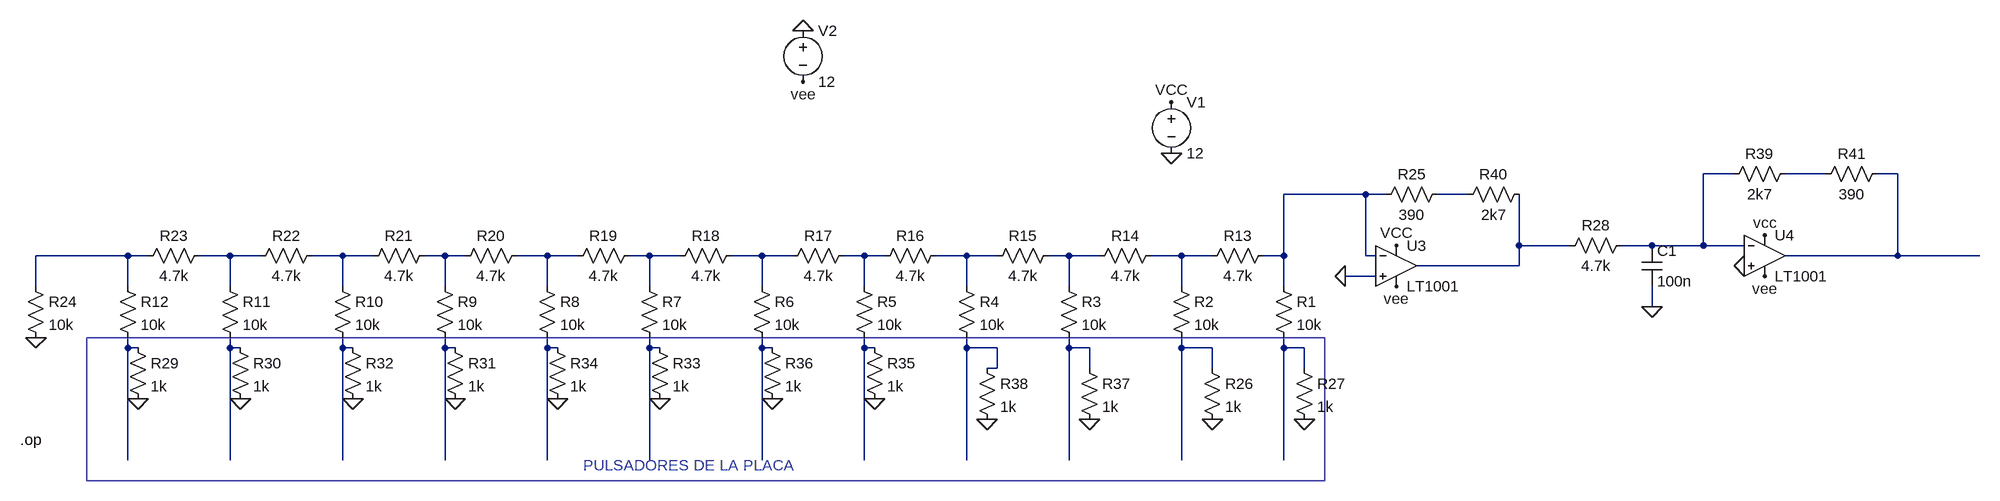
[diagram p0: schematic Teclado.asc]
Teclado.asc, the LTspice schematic file:
Version 4
SHEET 1 1376 680
WIRE 864 16 816 16
WIRE 1008 16 944 16
WIRE 1120 16 1088 16
WIRE 288 48 160 48
WIRE 320 48 288 48
WIRE 448 48 400 48
WIRE 528 128 528 48
WIRE 608 128 528 128
WIRE 736 128 688 128
WIRE 816 128 816 16
WIRE 816 128 736 128
WIRE 880 128 816 128
WIRE -1648 144 -1792 144
WIRE -1616 144 -1648 144
WIRE -1488 144 -1536 144
WIRE -1440 144 -1488 144
WIRE -1312 144 -1360 144
WIRE -1264 144 -1312 144
WIRE -1152 144 -1184 144
WIRE -1120 144 -1152 144
WIRE -992 144 -1040 144
WIRE -944 144 -992 144
WIRE -832 144 -864 144
WIRE -784 144 -832 144
WIRE -656 144 -704 144
WIRE -608 144 -656 144
WIRE -496 144 -528 144
WIRE -464 144 -496 144
WIRE -336 144 -384 144
WIRE -288 144 -336 144
WIRE -176 144 -208 144
WIRE -128 144 -176 144
WIRE 0 144 -48 144
WIRE 48 144 0 144
WIRE 160 144 160 48
WIRE 160 144 128 144
WIRE 288 144 288 48
WIRE 304 144 288 144
WIRE 1120 144 1120 16
WIRE 1120 144 944 144
WIRE 1248 144 1120 144
WIRE 528 160 528 128
WIRE 528 160 368 160
WIRE 304 176 256 176
WIRE -1792 192 -1792 144
WIRE -1648 192 -1648 144
WIRE -1488 192 -1488 144
WIRE -1312 192 -1312 144
WIRE -1152 192 -1152 144
WIRE -992 192 -992 144
WIRE -832 192 -832 144
WIRE -656 192 -656 144
WIRE -496 192 -496 144
WIRE -336 192 -336 144
WIRE -176 192 -176 144
WIRE 0 192 0 144
WIRE 160 192 160 144
WIRE 736 224 736 192
WIRE -1648 288 -1648 272
WIRE -1632 288 -1648 288
WIRE -1488 288 -1488 272
WIRE -1472 288 -1488 288
WIRE -1312 288 -1312 272
WIRE -1296 288 -1312 288
WIRE -1152 288 -1152 272
WIRE -1136 288 -1152 288
WIRE -992 288 -992 272
WIRE -976 288 -992 288
WIRE -832 288 -832 272
WIRE -816 288 -832 288
WIRE -656 288 -656 272
WIRE -640 288 -656 288
WIRE -496 288 -496 272
WIRE -480 288 -496 288
WIRE -336 288 -336 272
WIRE -288 288 -336 288
WIRE -176 288 -176 272
WIRE -144 288 -176 288
WIRE 0 288 0 272
WIRE 48 288 0 288
WIRE 160 288 160 272
WIRE 192 288 160 288
WIRE -288 320 -288 288
WIRE -288 320 -304 320
WIRE -144 320 -144 288
WIRE 48 320 48 288
WIRE 192 320 192 288
WIRE -1648 464 -1648 288
WIRE -1488 464 -1488 288
WIRE -1312 464 -1312 288
WIRE -1152 464 -1152 288
WIRE -992 464 -992 288
WIRE -832 464 -832 288
WIRE -656 464 -656 288
WIRE -496 464 -496 288
WIRE -336 464 -336 288
WIRE -176 464 -176 288
WIRE 0 464 0 288
WIRE 160 464 160 288
FLAG -1792 272 0
FLAG -16 -96 VCC
FLAG 336 128 VCC
FLAG 256 176 0
FLAG -144 400 0
FLAG -304 400 0
FLAG -480 368 0
FLAG -640 368 0
FLAG -816 368 0
FLAG -976 368 0
FLAG -1136 368 0
FLAG -1296 368 0
FLAG -1472 368 0
FLAG -1632 368 0
FLAG -592 -208 0
FLAG -592 -128 vee
FLAG 336 192 vee
FLAG -16 -16 0
FLAG 48 400 0
FLAG 192 400 0
FLAG 912 176 vee
FLAG 912 112 vcc
FLAG 880 160 0
FLAG 736 224 0
DATAFLAG 1232 144 ""
SYMBOL res 144 176 R0
SYMATTR InstName R1
SYMATTR Value 10k
SYMBOL res 144 128 R90
WINDOW 0 0 56 VBottom 2
WINDOW 3 32 56 VTop 2
SYMATTR InstName R13
SYMATTR Value 4.7k
SYMBOL voltage -16 -112 R0
WINDOW 123 0 0 Left 2
WINDOW 39 0 0 Left 2
SYMATTR InstName V1
SYMATTR Value 12
SYMBOL res -32 128 R90
WINDOW 0 0 56 VBottom 2
WINDOW 3 32 56 VTop 2
SYMATTR InstName R14
SYMATTR Value 4.7k
SYMBOL res -192 128 R90
WINDOW 0 0 56 VBottom 2
WINDOW 3 32 56 VTop 2
SYMATTR InstName R15
SYMATTR Value 4.7k
SYMBOL res -368 128 R90
WINDOW 0 0 56 VBottom 2
WINDOW 3 32 56 VTop 2
SYMATTR InstName R16
SYMATTR Value 4.7k
SYMBOL res -512 128 R90
WINDOW 0 0 56 VBottom 2
WINDOW 3 32 56 VTop 2
SYMATTR InstName R17
SYMATTR Value 4.7k
SYMBOL res -688 128 R90
WINDOW 0 0 56 VBottom 2
WINDOW 3 32 56 VTop 2
SYMATTR InstName R18
SYMATTR Value 4.7k
SYMBOL res -848 128 R90
WINDOW 0 0 56 VBottom 2
WINDOW 3 32 56 VTop 2
SYMATTR InstName R19
SYMATTR Value 4.7k
SYMBOL res -1024 128 R90
WINDOW 0 0 56 VBottom 2
WINDOW 3 32 56 VTop 2
SYMATTR InstName R20
SYMATTR Value 4.7k
SYMBOL res -1168 128 R90
WINDOW 0 0 56 VBottom 2
WINDOW 3 32 56 VTop 2
SYMATTR InstName R21
SYMATTR Value 4.7k
SYMBOL res -1344 128 R90
WINDOW 0 0 56 VBottom 2
WINDOW 3 32 56 VTop 2
SYMATTR InstName R22
SYMATTR Value 4.7k
SYMBOL res -1520 128 R90
WINDOW 0 0 56 VBottom 2
WINDOW 3 32 56 VTop 2
SYMATTR InstName R23
SYMATTR Value 4.7k
SYMBOL res -16 176 R0
SYMATTR InstName R2
SYMATTR Value 10k
SYMBOL res -192 176 R0
SYMATTR InstName R3
SYMATTR Value 10k
SYMBOL res -352 176 R0
SYMATTR InstName R4
SYMATTR Value 10k
SYMBOL res -512 176 R0
SYMATTR InstName R5
SYMATTR Value 10k
SYMBOL res -672 176 R0
SYMATTR InstName R6
SYMATTR Value 10k
SYMBOL res -848 176 R0
SYMATTR InstName R7
SYMATTR Value 10k
SYMBOL res -1008 176 R0
SYMATTR InstName R8
SYMATTR Value 10k
SYMBOL res -1168 176 R0
SYMATTR InstName R9
SYMATTR Value 10k
SYMBOL res -1328 176 R0
SYMATTR InstName R10
SYMATTR Value 10k
SYMBOL res -1504 176 R0
SYMATTR InstName R11
SYMATTR Value 10k
SYMBOL res -1664 176 R0
SYMATTR InstName R12
SYMATTR Value 10k
SYMBOL res -1808 176 R0
SYMATTR InstName R24
SYMATTR Value 10k
SYMBOL res -1488 272 R0
SYMATTR InstName R30
SYMATTR Value 1k
SYMBOL res -1648 272 R0
SYMATTR InstName R29
SYMATTR Value 1k
SYMBOL res -1152 272 R0
SYMATTR InstName R31
SYMATTR Value 1k
SYMBOL res -1312 272 R0
SYMATTR InstName R32
SYMATTR Value 1k
SYMBOL res -832 272 R0
SYMATTR InstName R33
SYMATTR Value 1k
SYMBOL res -992 272 R0
SYMATTR InstName R34
SYMATTR Value 1k
SYMBOL res -496 272 R0
SYMATTR InstName R35
SYMATTR Value 1k
SYMBOL res -656 272 R0
SYMATTR InstName R36
SYMATTR Value 1k
SYMBOL res -160 304 R0
SYMATTR InstName R37
SYMATTR Value 1k
SYMBOL res -320 304 R0
SYMATTR InstName R38
SYMATTR Value 1k
SYMBOL voltage -592 -224 R0
WINDOW 123 0 0 Left 2
WINDOW 39 0 0 Left 2
SYMATTR InstName V2
SYMATTR Value 12
SYMBOL res 32 304 R0
SYMATTR InstName R26
SYMATTR Value 1k
SYMBOL res 176 304 R0
SYMATTR InstName R27
SYMATTR Value 1k
SYMBOL res 960 0 R90
WINDOW 0 0 56 VBottom 2
WINDOW 3 32 56 VTop 2
SYMATTR InstName R39
SYMATTR Value 2k7
SYMBOL res 704 112 R90
WINDOW 0 0 56 VBottom 2
WINDOW 3 32 56 VTop 2
SYMATTR InstName R28
SYMATTR Value 4.7k
SYMBOL res 416 32 R90
WINDOW 0 0 56 VBottom 2
WINDOW 3 32 56 VTop 2
SYMATTR InstName R25
SYMATTR Value 390
SYMBOL res 544 32 R90
WINDOW 0 0 56 VBottom 2
WINDOW 3 32 56 VTop 2
SYMATTR InstName R40
SYMATTR Value 2k7
SYMBOL res 1104 0 R90
WINDOW 0 0 56 VBottom 2
WINDOW 3 32 56 VTop 2
SYMATTR InstName R41
SYMATTR Value 390
SYMBOL cap 720 128 R0
SYMATTR InstName C1
SYMATTR Value 100n
SYMBOL Opamps\\LT1001 336 96 R0
SYMATTR InstName U3
SYMBOL Opamps\\LT1001 912 80 R0
SYMATTR InstName U4
TEXT -1816 432 Left 2 !.op
TEXT -936 472 Left 2 ;PULSADORES DE LA PLACA
RECTANGLE Normal 224 496 -1712 272

The netlist it stands for:
* Teclado.asc
R1 N004 N029 10k
R13 N004 N017 4.7k
V1 VCC 0 12
R14 N017 N016 4.7k
R15 N016 N015 4.7k
R16 N015 N014 4.7k
R17 N014 N013 4.7k
R18 N013 N012 4.7k
R19 N012 N011 4.7k
R20 N011 N010 4.7k
R21 N010 N009 4.7k
R22 N009 N008 4.7k
R23 N008 N007 4.7k
R2 N017 N028 10k
R3 N016 N027 10k
R4 N015 N026 10k
R5 N014 N025 10k
R6 N013 N024 10k
R7 N012 N023 10k
R8 N011 N022 10k
R9 N010 N021 10k
R10 N009 N020 10k
R11 N008 N019 10k
R12 N007 N018 10k
R24 N007 0 10k
R30 N019 0 1k
R29 N018 0 1k
R31 N021 0 1k
R32 N020 0 1k
R33 N023 0 1k
R34 N022 0 1k
R35 N025 0 1k
R36 N024 0 1k
R37 N027 0 1k
R38 N026 0 1k
V2 0 vee 12
R26 N028 0 1k
R27 N029 0 1k
R39 N002 N001 2k7
R28 N001 N006 4.7k
R25 N005 N004 390
R40 N006 N005 2k7
R41 N003 N002 390
C1 N001 0 100n
XU3 0 N004 VCC vee N006 LT1001  ; pins In+ In- V+ V- OUT
XU4 0 N001 VCC vee N003 LT1001  ; pins In+ In- V+ V- OUT
.op
* PULSADORES DE LA PLACA
.lib LTC.lib
.backanno
.end